# EAGLE schematic LigthBox 2.0 (EAGLE 9.6.2)
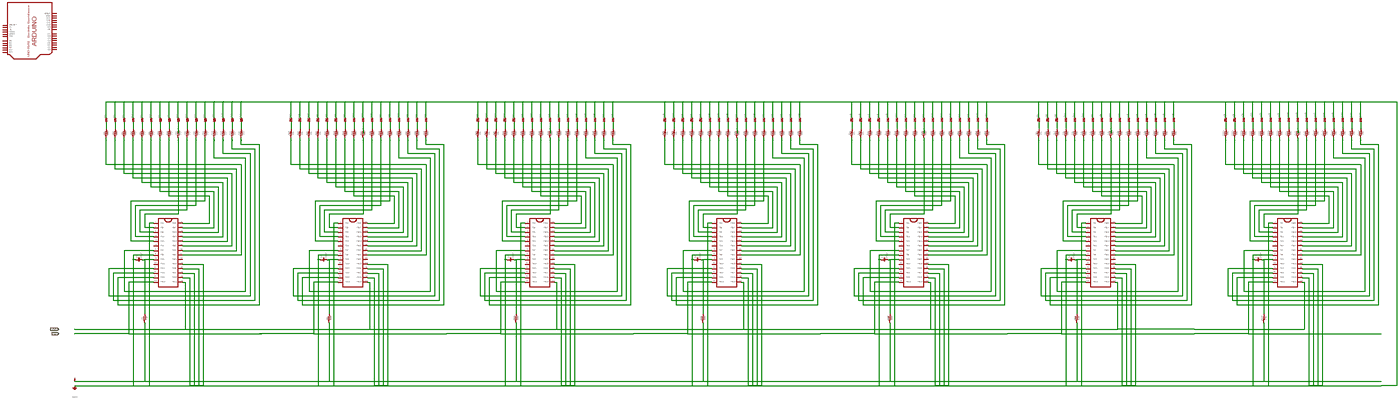
[diagram p0: schematic, sheet 1, overview]
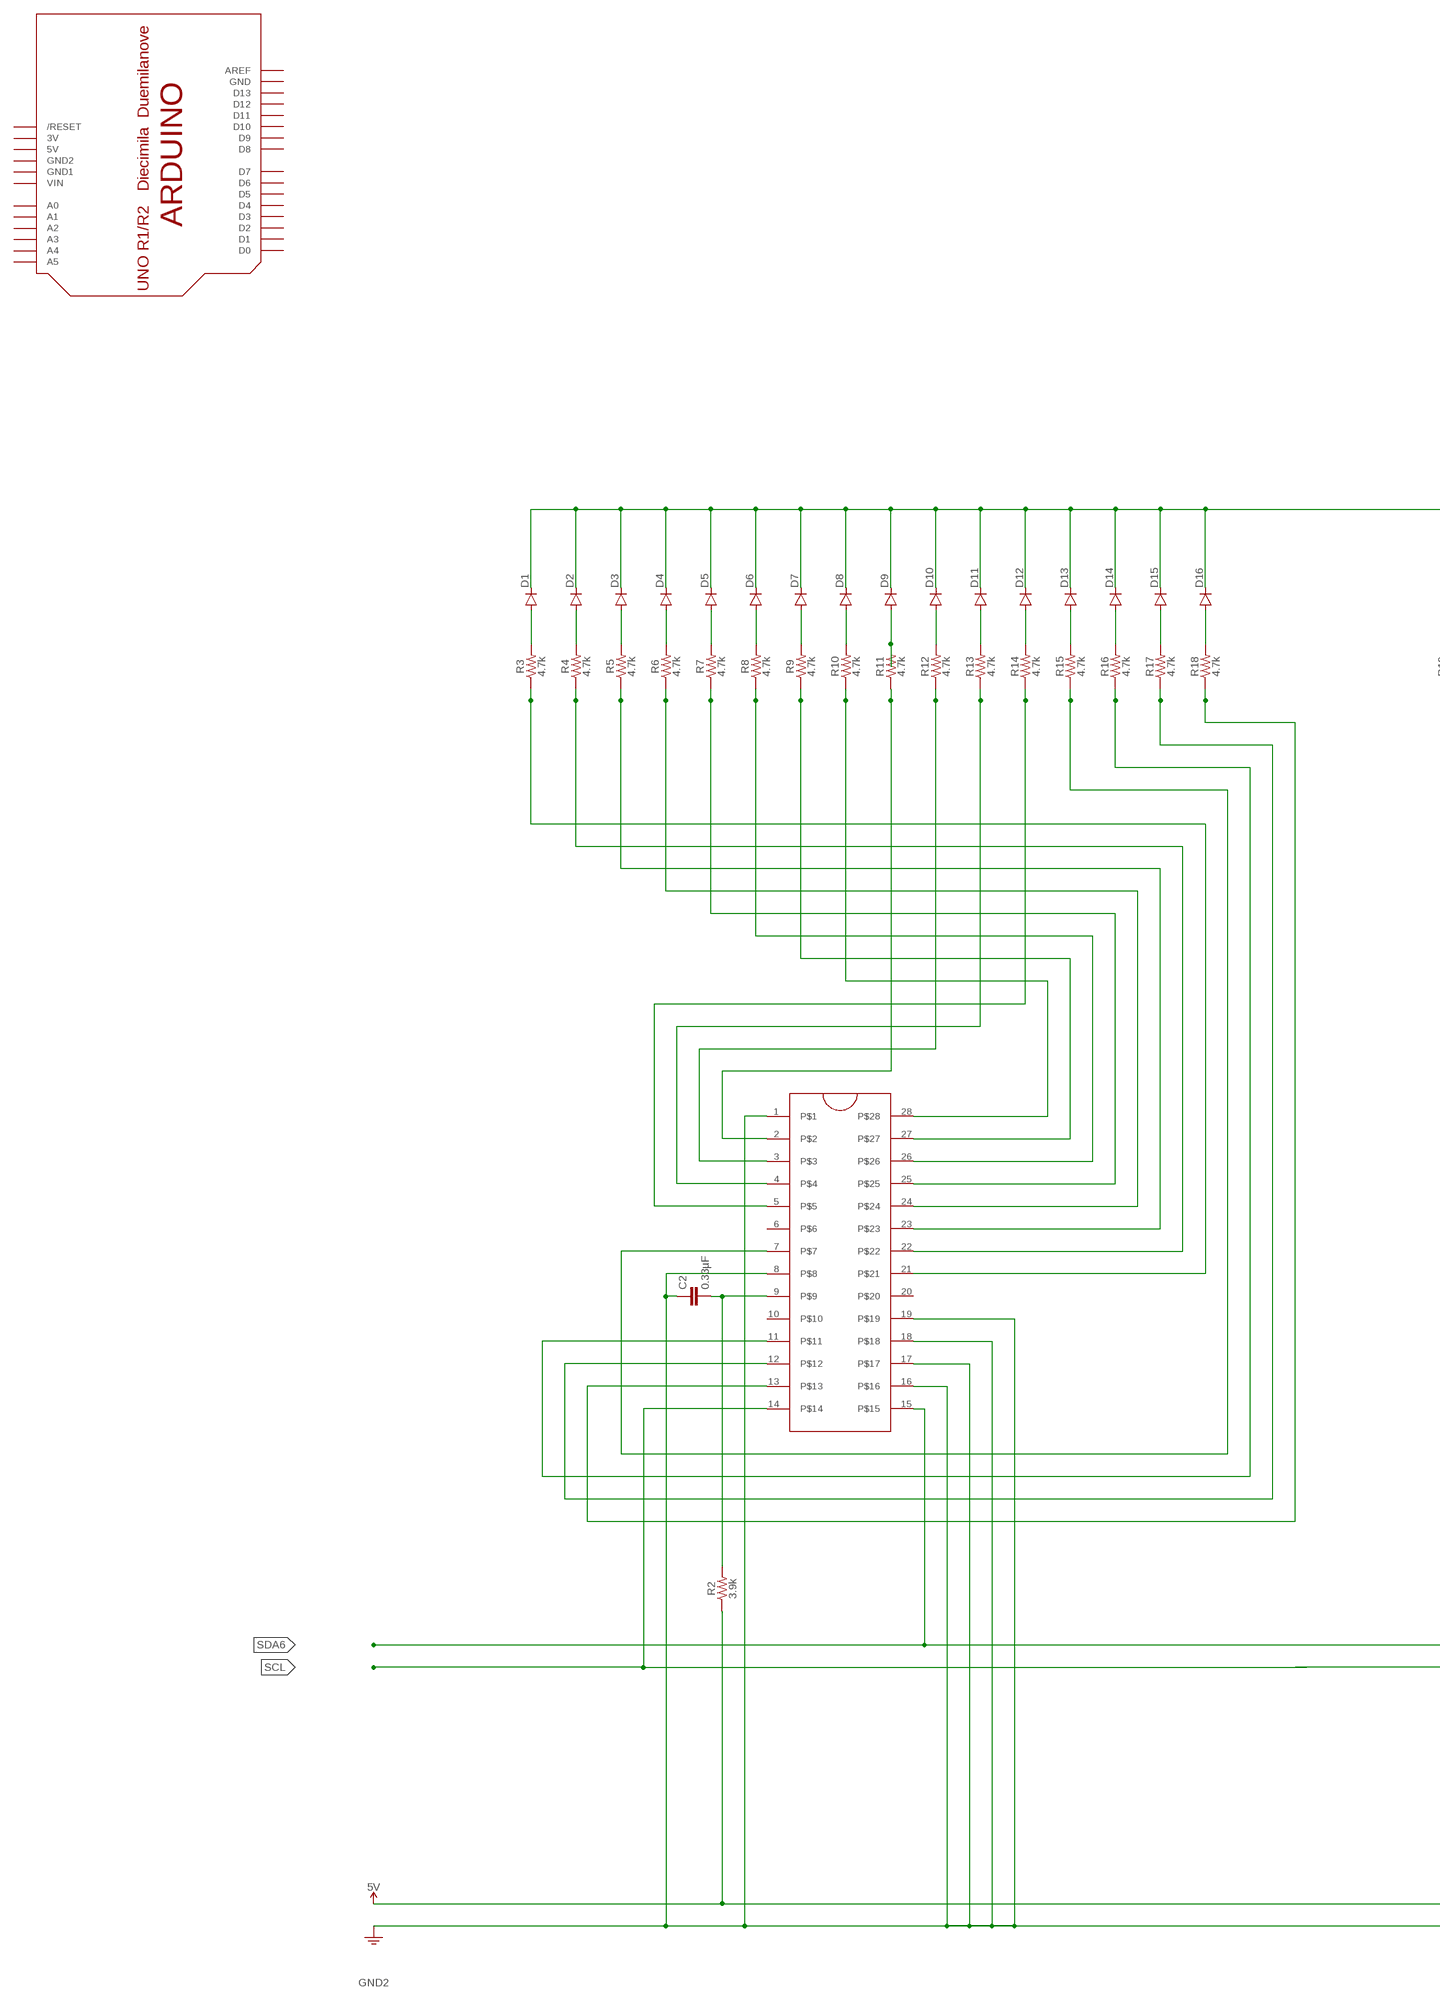
[diagram p1: schematic, sheet 1, part 1 of 4]
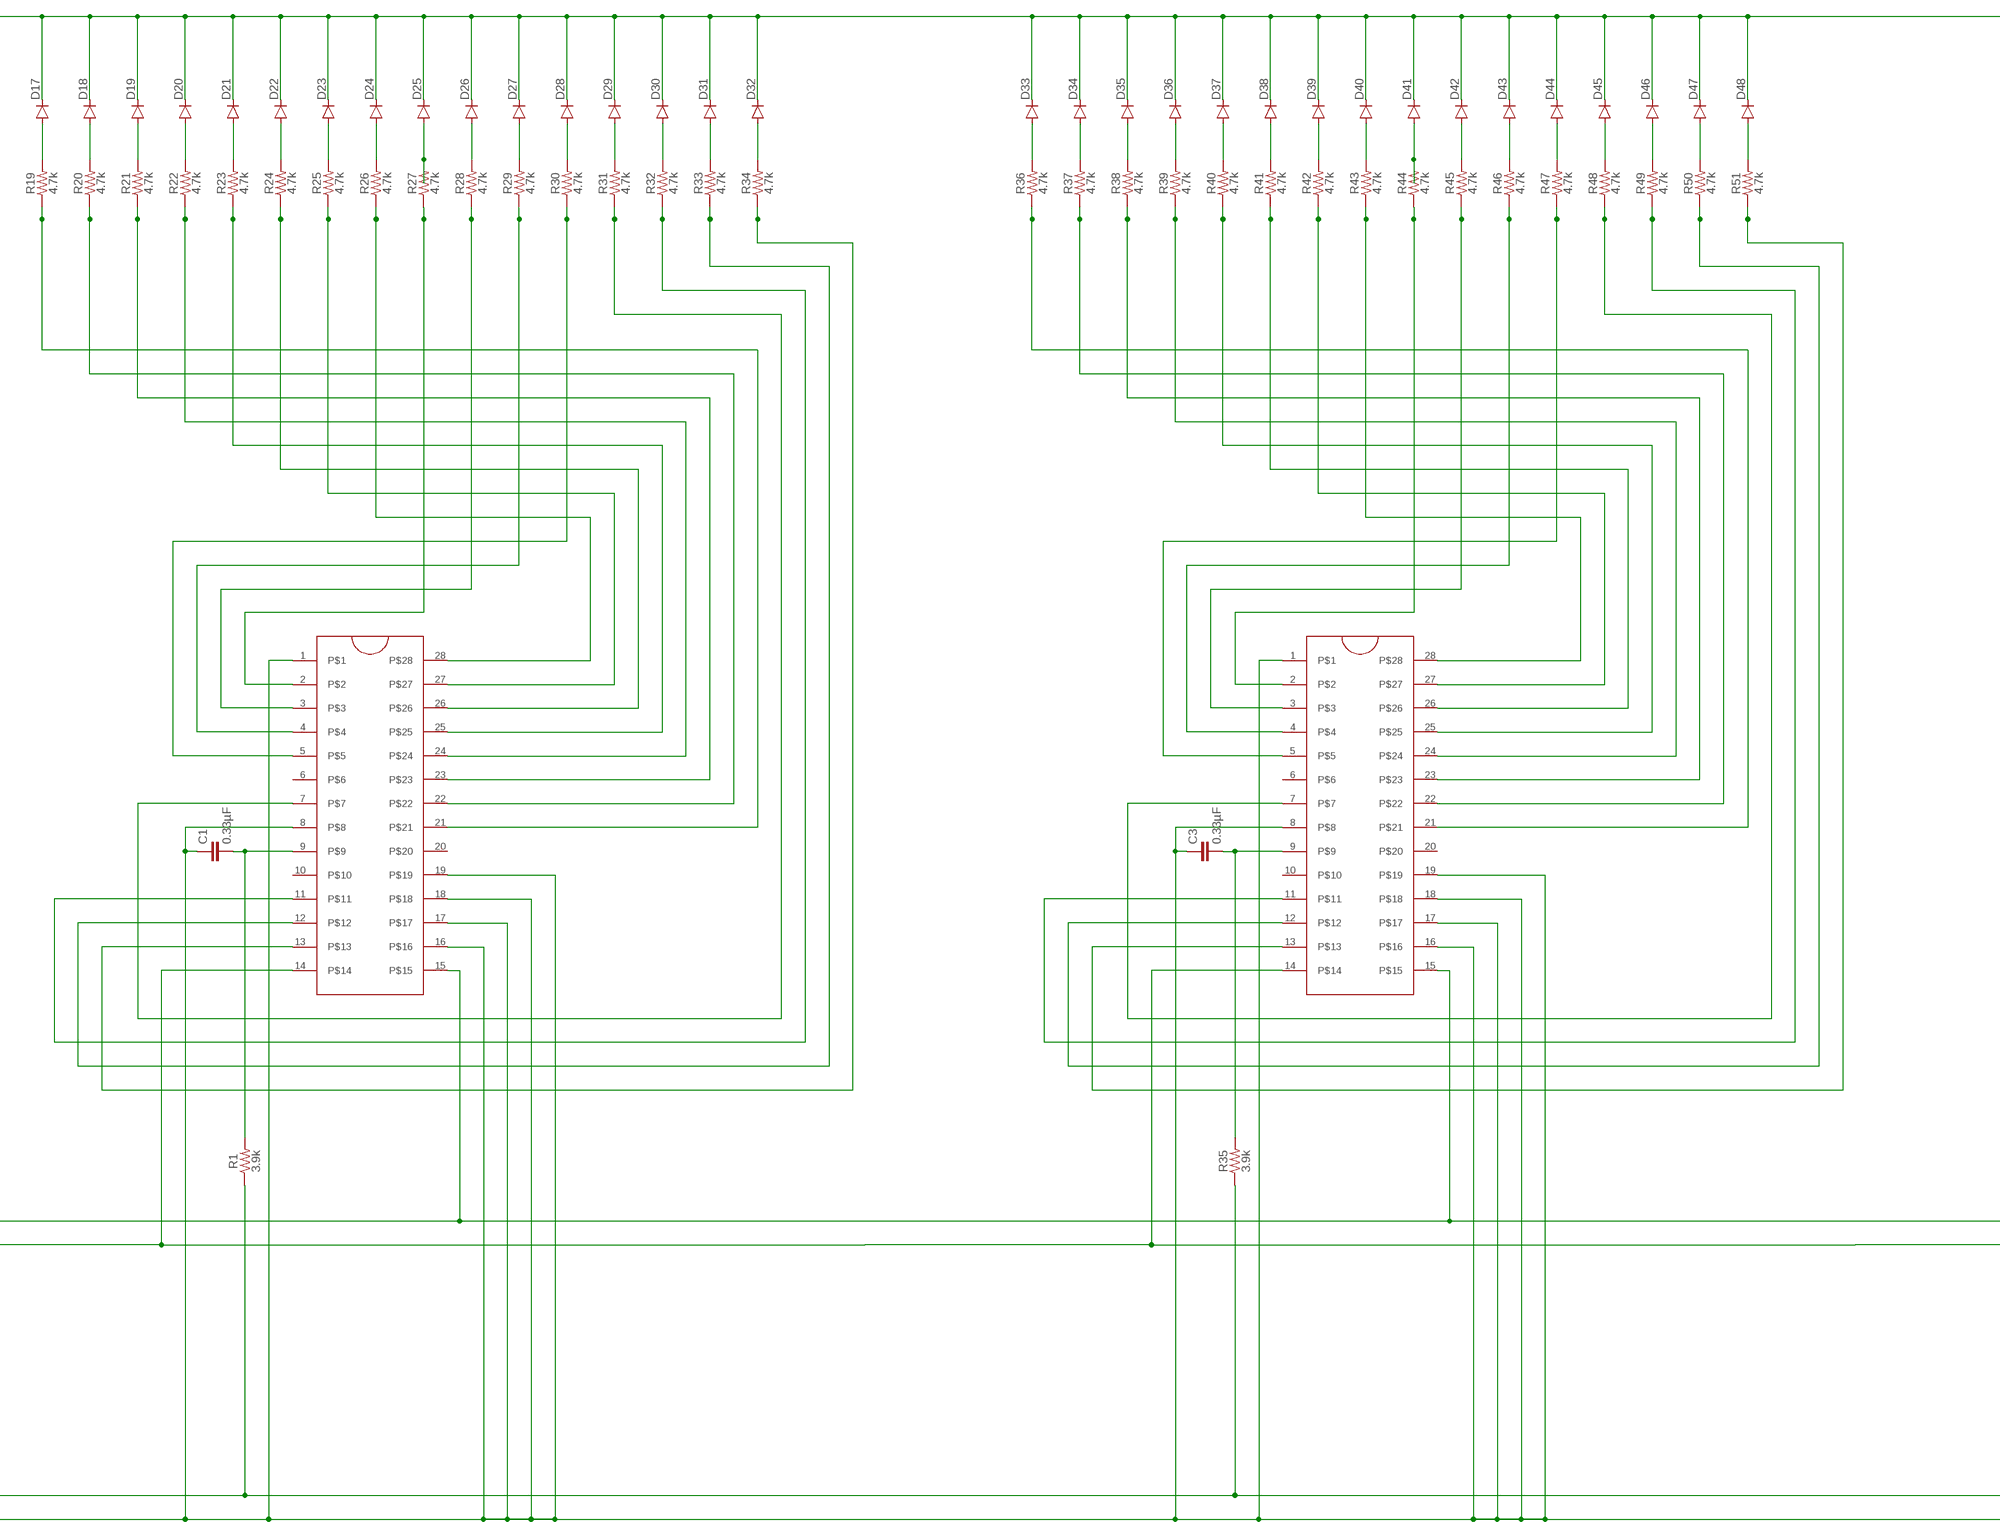
[diagram p2: schematic, sheet 1, part 2 of 4]
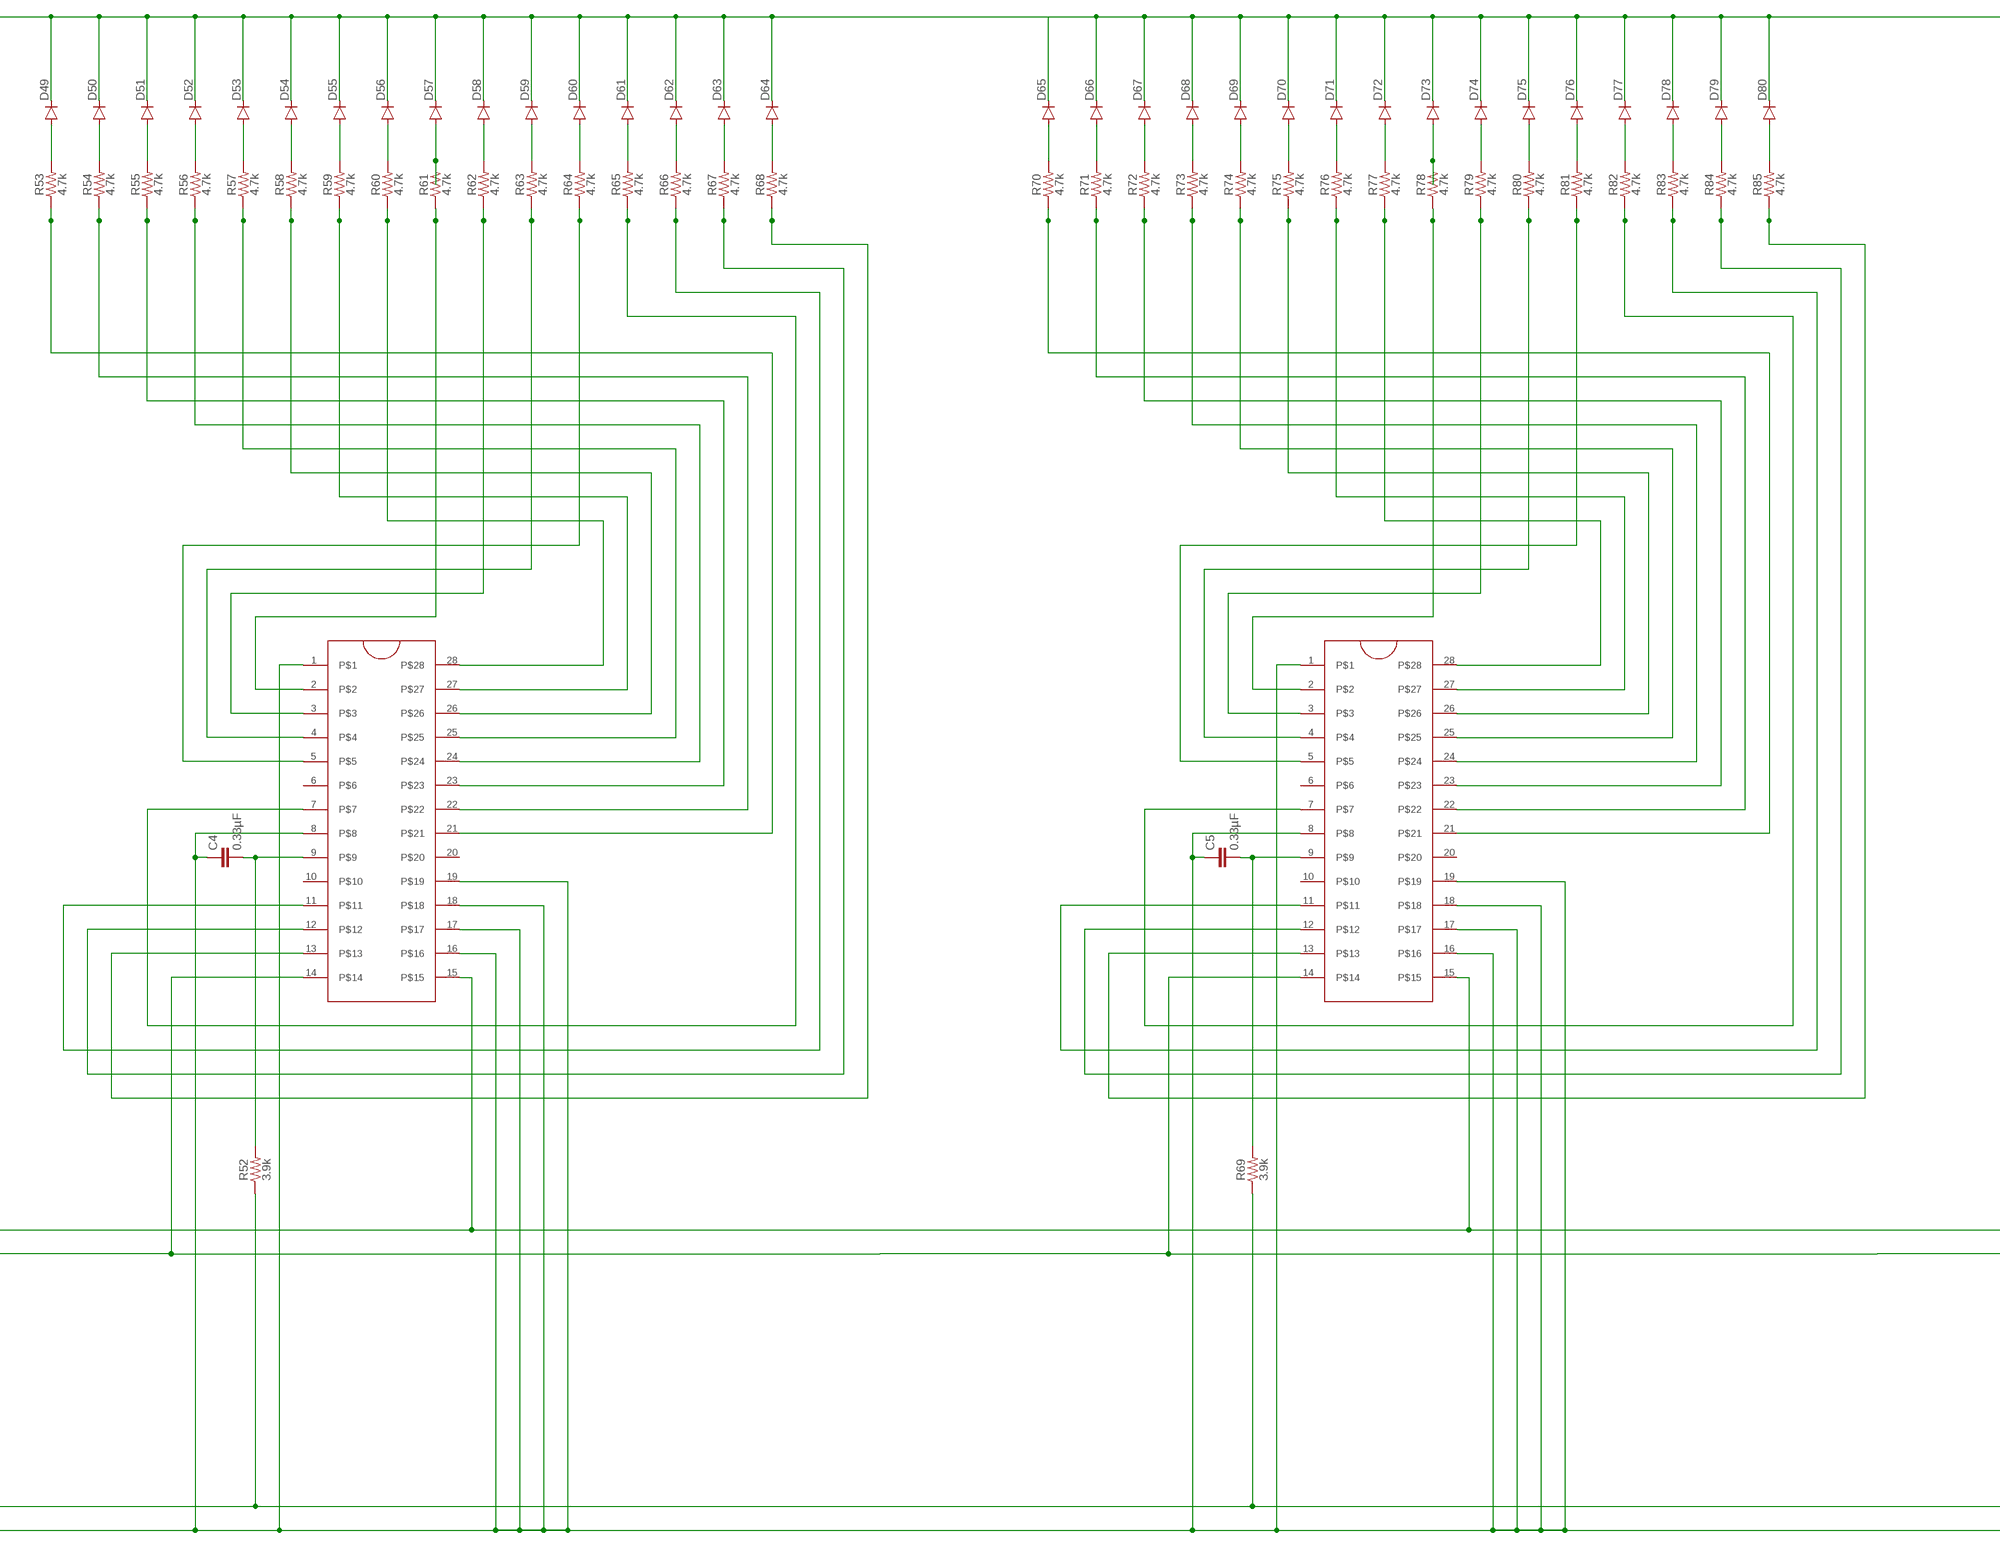
[diagram p3: schematic, sheet 1, part 3 of 4]
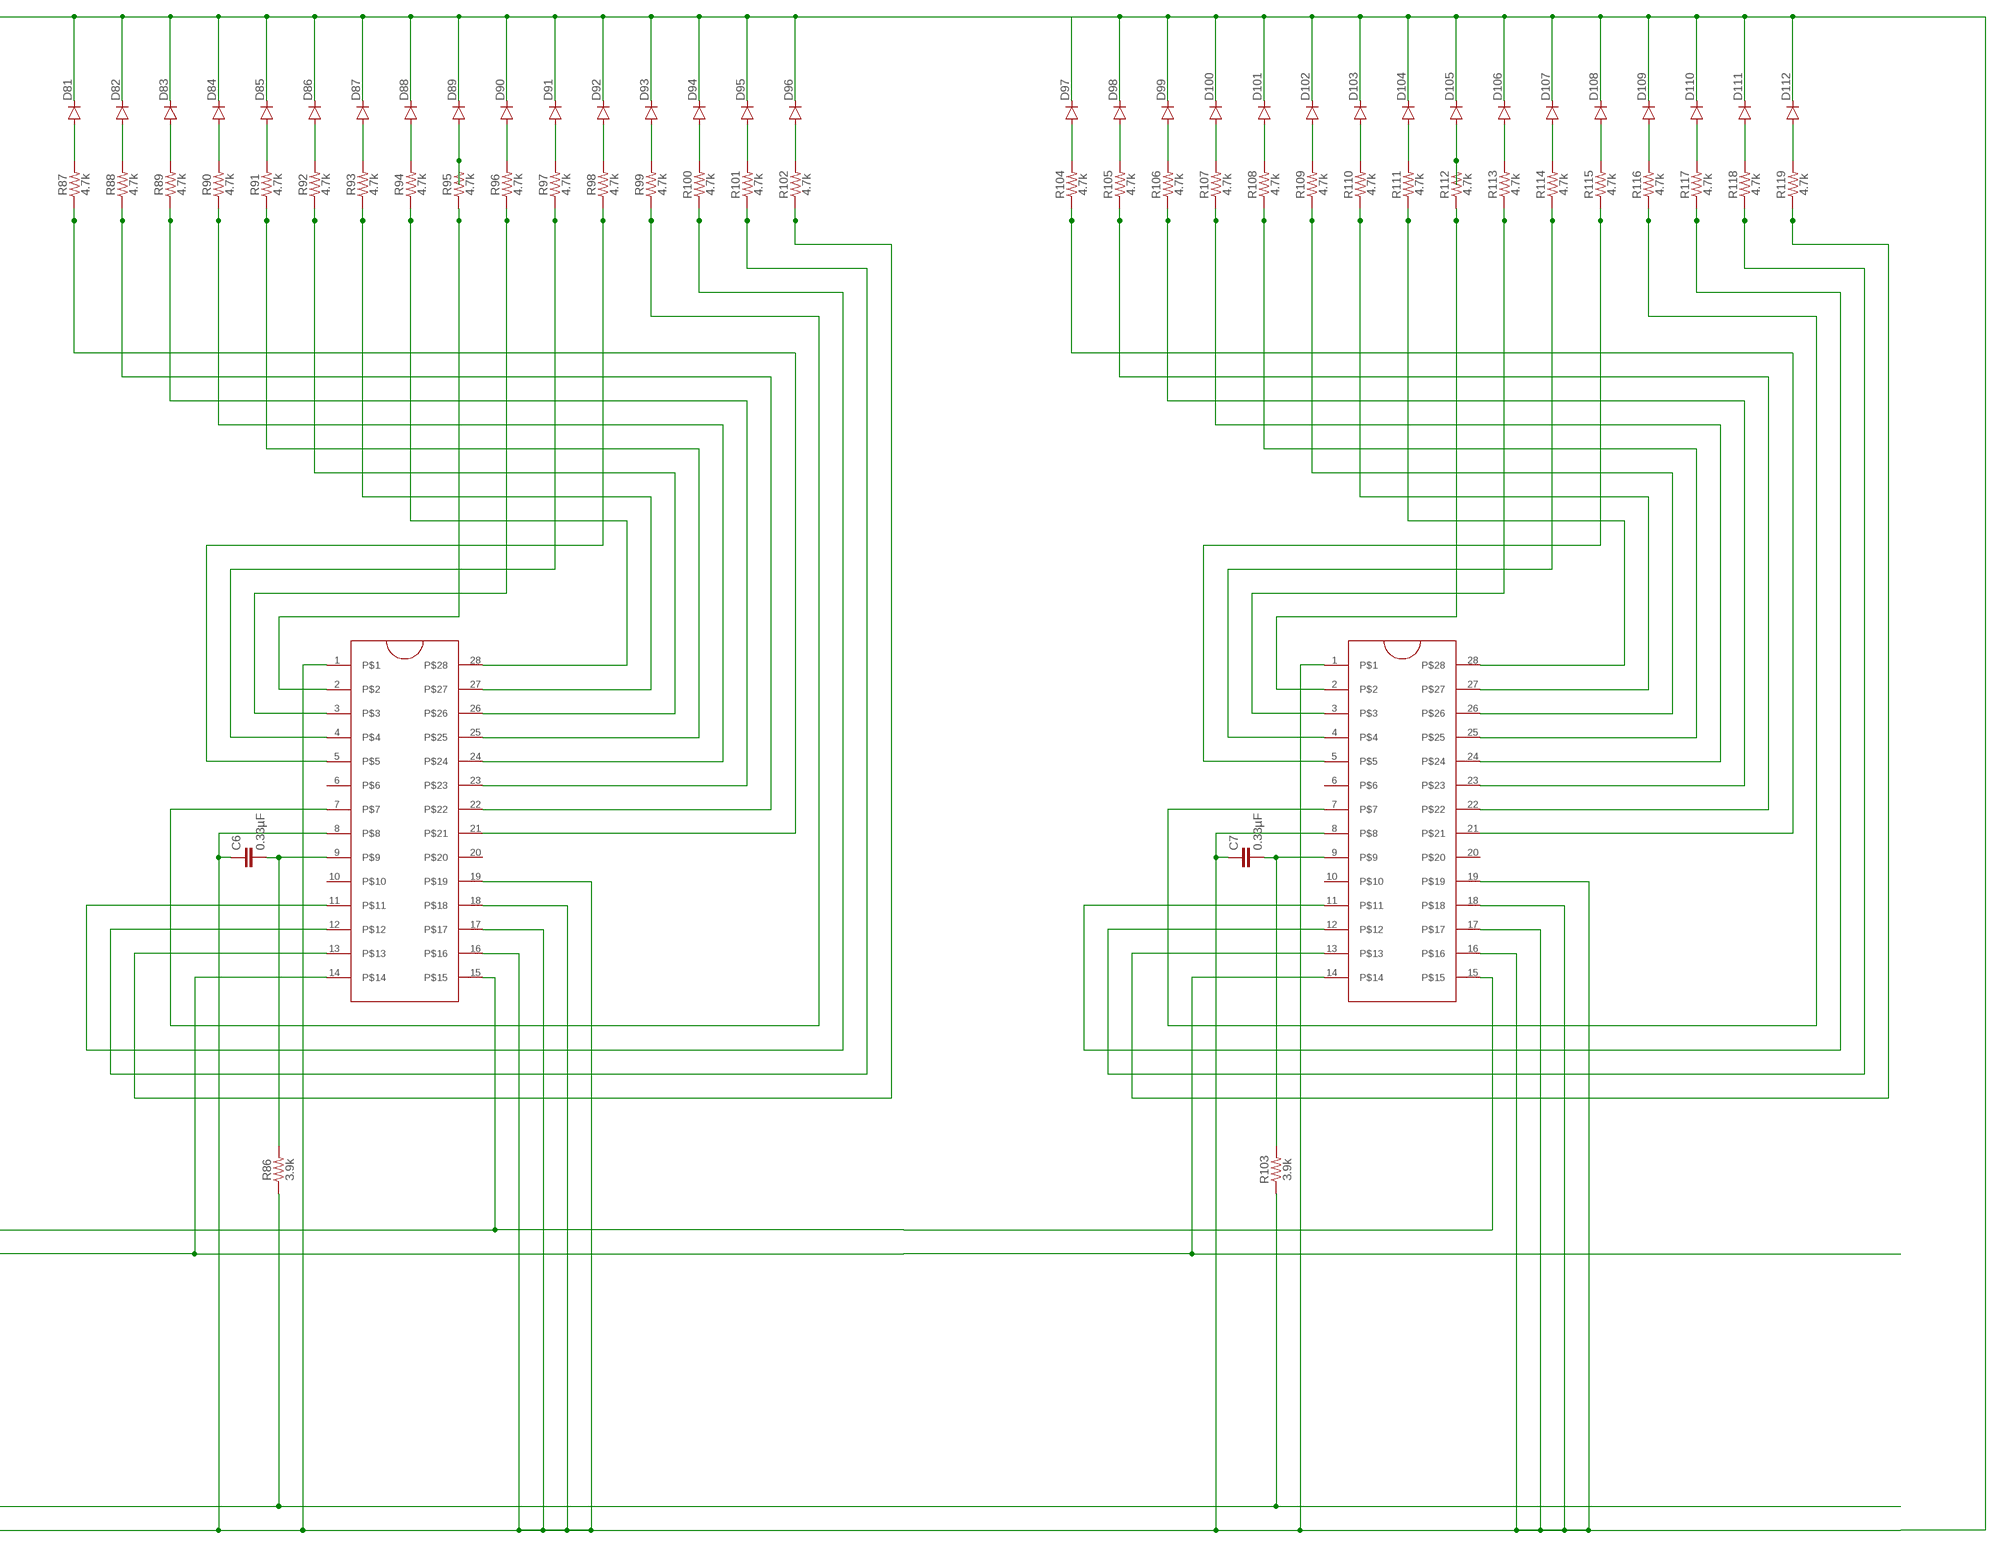
[diagram p4: schematic, sheet 1, part 4 of 4]

## Parts
C1  0.33µF  0.33UF/330NF-0805-50V-10%  [0805]
C2  0.33µF  0.33UF/330NF-0805-50V-10%  [0805]
C3  0.33µF  0.33UF/330NF-0805-50V-10%  [0805]
C4  0.33µF  0.33UF/330NF-0805-50V-10%  [0805]
C5  0.33µF  0.33UF/330NF-0805-50V-10%  [0805]
C6  0.33µF  0.33UF/330NF-0805-50V-10%  [0805]
C7  0.33µF  0.33UF/330NF-0805-50V-10%  [0805]
D1  DIODE-C1702-05  [C1702-05]
D2  DIODE-C1702-05  [C1702-05]
D3  DIODE-C1702-05  [C1702-05]
D4  DIODE-C1702-05  [C1702-05]
D5  DIODE-C1702-05  [C1702-05]
D6  DIODE-C1702-05  [C1702-05]
D7  DIODE-C1702-05  [C1702-05]
D8  DIODE-C1702-05  [C1702-05]
D9  DIODE-C1702-05  [C1702-05]
D10  DIODE-C1702-05  [C1702-05]
D11  DIODE-C1702-05  [C1702-05]
D12  DIODE-C1702-05  [C1702-05]
D13  DIODE-C1702-05  [C1702-05]
D14  DIODE-C1702-05  [C1702-05]
D15  DIODE-C1702-05  [C1702-05]
D16  DIODE-C1702-05  [C1702-05]
D17  DIODE-C1702-05  [C1702-05]
D18  DIODE-C1702-05  [C1702-05]
D19  DIODE-C1702-05  [C1702-05]
D20  DIODE-C1702-05  [C1702-05]
D21  DIODE-C1702-05  [C1702-05]
D22  DIODE-C1702-05  [C1702-05]
D23  DIODE-C1702-05  [C1702-05]
D24  DIODE-C1702-05  [C1702-05]
D25  DIODE-C1702-05  [C1702-05]
D26  DIODE-C1702-05  [C1702-05]
D27  DIODE-C1702-05  [C1702-05]
D28  DIODE-C1702-05  [C1702-05]
D29  DIODE-C1702-05  [C1702-05]
D30  DIODE-C1702-05  [C1702-05]
D31  DIODE-C1702-05  [C1702-05]
D32  DIODE-C1702-05  [C1702-05]
D33  DIODE-C1702-05  [C1702-05]
D34  DIODE-C1702-05  [C1702-05]
D35  DIODE-C1702-05  [C1702-05]
D36  DIODE-C1702-05  [C1702-05]
D37  DIODE-C1702-05  [C1702-05]
D38  DIODE-C1702-05  [C1702-05]
D39  DIODE-C1702-05  [C1702-05]
D40  DIODE-C1702-05  [C1702-05]
D41  DIODE-C1702-05  [C1702-05]
D42  DIODE-C1702-05  [C1702-05]
D43  DIODE-C1702-05  [C1702-05]
D44  DIODE-C1702-05  [C1702-05]
D45  DIODE-C1702-05  [C1702-05]
D46  DIODE-C1702-05  [C1702-05]
D47  DIODE-C1702-05  [C1702-05]
D48  DIODE-C1702-05  [C1702-05]
D49  DIODE-C1702-05  [C1702-05]
D50  DIODE-C1702-05  [C1702-05]
D51  DIODE-C1702-05  [C1702-05]
D52  DIODE-C1702-05  [C1702-05]
D53  DIODE-C1702-05  [C1702-05]
D54  DIODE-C1702-05  [C1702-05]
D55  DIODE-C1702-05  [C1702-05]
D56  DIODE-C1702-05  [C1702-05]
D57  DIODE-C1702-05  [C1702-05]
D58  DIODE-C1702-05  [C1702-05]
D59  DIODE-C1702-05  [C1702-05]
D60  DIODE-C1702-05  [C1702-05]
D61  DIODE-C1702-05  [C1702-05]
D62  DIODE-C1702-05  [C1702-05]
D63  DIODE-C1702-05  [C1702-05]
D64  DIODE-C1702-05  [C1702-05]
D65  DIODE-C1702-05  [C1702-05]
D66  DIODE-C1702-05  [C1702-05]
D67  DIODE-C1702-05  [C1702-05]
D68  DIODE-C1702-05  [C1702-05]
D69  DIODE-C1702-05  [C1702-05]
D70  DIODE-C1702-05  [C1702-05]
D71  DIODE-C1702-05  [C1702-05]
D72  DIODE-C1702-05  [C1702-05]
D73  DIODE-C1702-05  [C1702-05]
D74  DIODE-C1702-05  [C1702-05]
D75  DIODE-C1702-05  [C1702-05]
D76  DIODE-C1702-05  [C1702-05]
D77  DIODE-C1702-05  [C1702-05]
D78  DIODE-C1702-05  [C1702-05]
D79  DIODE-C1702-05  [C1702-05]
D80  DIODE-C1702-05  [C1702-05]
D81  DIODE-C1702-05  [C1702-05]
D82  DIODE-C1702-05  [C1702-05]
D83  DIODE-C1702-05  [C1702-05]
D84  DIODE-C1702-05  [C1702-05]
D85  DIODE-C1702-05  [C1702-05]
D86  DIODE-C1702-05  [C1702-05]
D87  DIODE-C1702-05  [C1702-05]
D88  DIODE-C1702-05  [C1702-05]
D89  DIODE-C1702-05  [C1702-05]
D90  DIODE-C1702-05  [C1702-05]
D91  DIODE-C1702-05  [C1702-05]
D92  DIODE-C1702-05  [C1702-05]
D93  DIODE-C1702-05  [C1702-05]
D94  DIODE-C1702-05  [C1702-05]
D95  DIODE-C1702-05  [C1702-05]
D96  DIODE-C1702-05  [C1702-05]
D97  DIODE-C1702-05  [C1702-05]
D98  DIODE-C1702-05  [C1702-05]
D99  DIODE-C1702-05  [C1702-05]
D100  DIODE-C1702-05  [C1702-05]
D101  DIODE-C1702-05  [C1702-05]
D102  DIODE-C1702-05  [C1702-05]
D103  DIODE-C1702-05  [C1702-05]
D104  DIODE-C1702-05  [C1702-05]
D105  DIODE-C1702-05  [C1702-05]
D106  DIODE-C1702-05  [C1702-05]
D107  DIODE-C1702-05  [C1702-05]
D108  DIODE-C1702-05  [C1702-05]
D109  DIODE-C1702-05  [C1702-05]
D110  DIODE-C1702-05  [C1702-05]
D111  DIODE-C1702-05  [C1702-05]
D112  DIODE-C1702-05  [C1702-05]
J1  ZIFSOCKET-28-3"  [DIL28-3-ZIF_SOCKET]
J2  ZIFSOCKET-28-3"  [DIL28-3-ZIF_SOCKET]
J3  ZIFSOCKET-28-3"  [DIL28-3-ZIF_SOCKET]
J4  ZIFSOCKET-28-3"  [DIL28-3-ZIF_SOCKET]
J5  ZIFSOCKET-28-3"  [DIL28-3-ZIF_SOCKET]
J6  ZIFSOCKET-28-3"  [DIL28-3-ZIF_SOCKET]
J7  ZIFSOCKET-28-3"  [DIL28-3-ZIF_SOCKET]
R1  3.9k  3.9KOHM-0603-1/10W-1%  [0603]
R2  3.9k  3.9KOHM-0603-1/10W-1%  [0603]
R3  4.7k  4.7KOHM-0603-1/10W-1%  [0603]
R4  4.7k  4.7KOHM-0603-1/10W-1%  [0603]
R5  4.7k  4.7KOHM-0603-1/10W-1%  [0603]
R6  4.7k  4.7KOHM-0603-1/10W-1%  [0603]
R7  4.7k  4.7KOHM-0603-1/10W-1%  [0603]
R8  4.7k  4.7KOHM-0603-1/10W-1%  [0603]
R9  4.7k  4.7KOHM-0603-1/10W-1%  [0603]
R10  4.7k  4.7KOHM-0603-1/10W-1%  [0603]
R11  4.7k  4.7KOHM-0603-1/10W-1%  [0603]
R12  4.7k  4.7KOHM-0603-1/10W-1%  [0603]
R13  4.7k  4.7KOHM-0603-1/10W-1%  [0603]
R14  4.7k  4.7KOHM-0603-1/10W-1%  [0603]
R15  4.7k  4.7KOHM-0603-1/10W-1%  [0603]
R16  4.7k  4.7KOHM-0603-1/10W-1%  [0603]
R17  4.7k  4.7KOHM-0603-1/10W-1%  [0603]
R18  4.7k  4.7KOHM-0603-1/10W-1%  [0603]
R19  4.7k  4.7KOHM-0603-1/10W-1%  [0603]
R20  4.7k  4.7KOHM-0603-1/10W-1%  [0603]
R21  4.7k  4.7KOHM-0603-1/10W-1%  [0603]
R22  4.7k  4.7KOHM-0603-1/10W-1%  [0603]
R23  4.7k  4.7KOHM-0603-1/10W-1%  [0603]
R24  4.7k  4.7KOHM-0603-1/10W-1%  [0603]
R25  4.7k  4.7KOHM-0603-1/10W-1%  [0603]
R26  4.7k  4.7KOHM-0603-1/10W-1%  [0603]
R27  4.7k  4.7KOHM-0603-1/10W-1%  [0603]
R28  4.7k  4.7KOHM-0603-1/10W-1%  [0603]
R29  4.7k  4.7KOHM-0603-1/10W-1%  [0603]
R30  4.7k  4.7KOHM-0603-1/10W-1%  [0603]
R31  4.7k  4.7KOHM-0603-1/10W-1%  [0603]
R32  4.7k  4.7KOHM-0603-1/10W-1%  [0603]
R33  4.7k  4.7KOHM-0603-1/10W-1%  [0603]
R34  4.7k  4.7KOHM-0603-1/10W-1%  [0603]
R35  3.9k  3.9KOHM-0603-1/10W-1%  [0603]
R36  4.7k  4.7KOHM-0603-1/10W-1%  [0603]
R37  4.7k  4.7KOHM-0603-1/10W-1%  [0603]
R38  4.7k  4.7KOHM-0603-1/10W-1%  [0603]
R39  4.7k  4.7KOHM-0603-1/10W-1%  [0603]
R40  4.7k  4.7KOHM-0603-1/10W-1%  [0603]
R41  4.7k  4.7KOHM-0603-1/10W-1%  [0603]
R42  4.7k  4.7KOHM-0603-1/10W-1%  [0603]
R43  4.7k  4.7KOHM-0603-1/10W-1%  [0603]
R44  4.7k  4.7KOHM-0603-1/10W-1%  [0603]
R45  4.7k  4.7KOHM-0603-1/10W-1%  [0603]
R46  4.7k  4.7KOHM-0603-1/10W-1%  [0603]
R47  4.7k  4.7KOHM-0603-1/10W-1%  [0603]
R48  4.7k  4.7KOHM-0603-1/10W-1%  [0603]
R49  4.7k  4.7KOHM-0603-1/10W-1%  [0603]
R50  4.7k  4.7KOHM-0603-1/10W-1%  [0603]
R51  4.7k  4.7KOHM-0603-1/10W-1%  [0603]
R52  3.9k  3.9KOHM-0603-1/10W-1%  [0603]
R53  4.7k  4.7KOHM-0603-1/10W-1%  [0603]
R54  4.7k  4.7KOHM-0603-1/10W-1%  [0603]
R55  4.7k  4.7KOHM-0603-1/10W-1%  [0603]
R56  4.7k  4.7KOHM-0603-1/10W-1%  [0603]
R57  4.7k  4.7KOHM-0603-1/10W-1%  [0603]
R58  4.7k  4.7KOHM-0603-1/10W-1%  [0603]
R59  4.7k  4.7KOHM-0603-1/10W-1%  [0603]
R60  4.7k  4.7KOHM-0603-1/10W-1%  [0603]
R61  4.7k  4.7KOHM-0603-1/10W-1%  [0603]
R62  4.7k  4.7KOHM-0603-1/10W-1%  [0603]
R63  4.7k  4.7KOHM-0603-1/10W-1%  [0603]
R64  4.7k  4.7KOHM-0603-1/10W-1%  [0603]
R65  4.7k  4.7KOHM-0603-1/10W-1%  [0603]
R66  4.7k  4.7KOHM-0603-1/10W-1%  [0603]
R67  4.7k  4.7KOHM-0603-1/10W-1%  [0603]
R68  4.7k  4.7KOHM-0603-1/10W-1%  [0603]
R69  3.9k  3.9KOHM-0603-1/10W-1%  [0603]
R70  4.7k  4.7KOHM-0603-1/10W-1%  [0603]
R71  4.7k  4.7KOHM-0603-1/10W-1%  [0603]
R72  4.7k  4.7KOHM-0603-1/10W-1%  [0603]
R73  4.7k  4.7KOHM-0603-1/10W-1%  [0603]
R74  4.7k  4.7KOHM-0603-1/10W-1%  [0603]
R75  4.7k  4.7KOHM-0603-1/10W-1%  [0603]
R76  4.7k  4.7KOHM-0603-1/10W-1%  [0603]
R77  4.7k  4.7KOHM-0603-1/10W-1%  [0603]
R78  4.7k  4.7KOHM-0603-1/10W-1%  [0603]
R79  4.7k  4.7KOHM-0603-1/10W-1%  [0603]
R80  4.7k  4.7KOHM-0603-1/10W-1%  [0603]
R81  4.7k  4.7KOHM-0603-1/10W-1%  [0603]
R82  4.7k  4.7KOHM-0603-1/10W-1%  [0603]
R83  4.7k  4.7KOHM-0603-1/10W-1%  [0603]
R84  4.7k  4.7KOHM-0603-1/10W-1%  [0603]
R85  4.7k  4.7KOHM-0603-1/10W-1%  [0603]
R86  3.9k  3.9KOHM-0603-1/10W-1%  [0603]
R87  4.7k  4.7KOHM-0603-1/10W-1%  [0603]
R88  4.7k  4.7KOHM-0603-1/10W-1%  [0603]
R89  4.7k  4.7KOHM-0603-1/10W-1%  [0603]
R90  4.7k  4.7KOHM-0603-1/10W-1%  [0603]
R91  4.7k  4.7KOHM-0603-1/10W-1%  [0603]
R92  4.7k  4.7KOHM-0603-1/10W-1%  [0603]
R93  4.7k  4.7KOHM-0603-1/10W-1%  [0603]
R94  4.7k  4.7KOHM-0603-1/10W-1%  [0603]
R95  4.7k  4.7KOHM-0603-1/10W-1%  [0603]
R96  4.7k  4.7KOHM-0603-1/10W-1%  [0603]
R97  4.7k  4.7KOHM-0603-1/10W-1%  [0603]
R98  4.7k  4.7KOHM-0603-1/10W-1%  [0603]
R99  4.7k  4.7KOHM-0603-1/10W-1%  [0603]
R100  4.7k  4.7KOHM-0603-1/10W-1%  [0603]
R101  4.7k  4.7KOHM-0603-1/10W-1%  [0603]
R102  4.7k  4.7KOHM-0603-1/10W-1%  [0603]
R103  3.9k  3.9KOHM-0603-1/10W-1%  [0603]
R104  4.7k  4.7KOHM-0603-1/10W-1%  [0603]
R105  4.7k  4.7KOHM-0603-1/10W-1%  [0603]
R106  4.7k  4.7KOHM-0603-1/10W-1%  [0603]
R107  4.7k  4.7KOHM-0603-1/10W-1%  [0603]
R108  4.7k  4.7KOHM-0603-1/10W-1%  [0603]
R109  4.7k  4.7KOHM-0603-1/10W-1%  [0603]
R110  4.7k  4.7KOHM-0603-1/10W-1%  [0603]
R111  4.7k  4.7KOHM-0603-1/10W-1%  [0603]
R112  4.7k  4.7KOHM-0603-1/10W-1%  [0603]
R113  4.7k  4.7KOHM-0603-1/10W-1%  [0603]
R114  4.7k  4.7KOHM-0603-1/10W-1%  [0603]
R115  4.7k  4.7KOHM-0603-1/10W-1%  [0603]
R116  4.7k  4.7KOHM-0603-1/10W-1%  [0603]
R117  4.7k  4.7KOHM-0603-1/10W-1%  [0603]
R118  4.7k  4.7KOHM-0603-1/10W-1%  [0603]
R119  4.7k  4.7KOHM-0603-1/10W-1%  [0603]
U$1  ARDUINO-BPLACE  [ARDUINO-BPLACE]

## Nets
3.3V: C2.1 J1.1 J1.8 J1.16 J1.17 J1.18 J1.19 ; supply symbol labelled GND2
3.3V2: C1.1 J2.1 J2.8 J2.16 J2.17 J2.18 J2.19
3.3V4: C3.1 J3.1 J3.8 J3.16 J3.17 J3.18 J3.19
3.3V6: C4.1 J4.1 J4.8 J4.16 J4.17 J4.18 J4.19
3.3V8: C5.1 J5.1 J5.8 J5.16 J5.17 J5.18 J5.19
3.3V10: C6.1 C7.1 D1.C D2.C D3.C D4.C D5.C D6.C D7.C D8.C D9.C D10.C D11.C D12.C D13.C D14.C D15.C D16.C D17.C D18.C D19.C D20.C D21.C D22.C D23.C D24.C D25.C D26.C D27.C D28.C D29.C D30.C D31.C D32.C D33.C D34.C D35.C D36.C D37.C D38.C D39.C D40.C D41.C D42.C D43.C D44.C D45.C D46.C D47.C D48.C D49.C D50.C D51.C D52.C D53.C D54.C D55.C D56.C D57.C D58.C D59.C D60.C D61.C D62.C D63.C D64.C D65.C D66.C D67.C D68.C D69.C D70.C D71.C D72.C D73.C D74.C D75.C D76.C D77.C D78.C D79.C D80.C D81.C D82.C D83.C D84.C D85.C D86.C D87.C D88.C D89.C D90.C D91.C D92.C D93.C D94.C D95.C D96.C D97.C D98.C D99.C D100.C D101.C D102.C D103.C D104.C D105.C D106.C D107.C D108.C D109.C D110.C D111.C D112.C J6.1 J6.8 J6.16 J6.17 J6.18 J6.19 J7.1 J7.8 J7.16 J7.17 J7.18 J7.19
5V: R2.1
5V1: R1.1
5V2: R35.1
5V3: R52.1
5V4: R69.1
5V5: R86.1
5V6: R103.1
N$1: J1.11 R16.1
N$2: C2.2 J1.9 R2.2
N$3: J1.12 R17.1
N$4: J1.13 R18.1
N$5: D4.A R6.2
N$6: D5.A R7.2
N$7: D6.A R8.2
N$8: D1.A R3.2
N$9: D2.A R4.2
N$10: D7.A R9.2
N$11: D8.A R10.2
N$12: D9.A R11.2
N$13: D10.A R12.2
N$14: D11.A R13.2
N$15: D12.A R14.2
N$16: D13.A R15.2
N$17: D14.A R16.2
N$18: D15.A R17.2
N$19: D16.A R18.2
N$20: C1.2 J2.9 R1.2
N$21: D17.A R19.2
N$22: D18.A R20.2
N$23: D19.A R21.2
N$24: J2.21 R19.1
N$25: J2.22 R20.1
N$26: D3.A R5.2
N$27: J1.21 R3.1
N$28: J1.22 R4.1
N$29: J1.23 R5.1
N$30: J1.24 R6.1
N$31: J1.25 R7.1
N$32: J1.26 R8.1
N$33: J2.23 R21.1
N$34: J1.27 R9.1
N$35: J1.28 R10.1
N$36: J1.2 R11.1
N$37: J1.3 R12.1
N$38: J1.4 R13.1
N$39: J1.5 R14.1
N$40: J2.24 R22.1
N$41: J1.7 R15.1
N$42: J2.25 R23.1
N$43: J2.26 R24.1
N$44: J2.27 R25.1
N$45: J2.28 R26.1
N$46: J2.2 R27.1
N$47: J2.3 R28.1
N$48: J2.4 R29.1
N$49: J2.5 R30.1
N$50: J2.7 R31.1
N$51: J2.11 R32.1
N$52: J2.12 R33.1
N$53: J2.13 R34.1
N$54: D20.A R22.2
N$55: D21.A R23.2
N$56: D22.A R24.2
N$57: D23.A R25.2
N$58: D24.A R26.2
N$59: D25.A R27.2
N$60: D26.A R28.2
N$61: D27.A R29.2
N$62: D28.A R30.2
N$63: D29.A R31.2
N$64: D30.A R32.2
N$65: D31.A R33.2
N$66: D32.A R34.2
N$67: C3.2 J3.9 R35.2
N$68: D33.A R36.2
N$69: D34.A R37.2
N$70: D35.A R38.2
N$71: J3.21 R36.1
N$72: J3.22 R37.1
N$73: J3.23 R38.1
N$74: J3.24 R39.1
N$75: J3.25 R40.1
N$76: J3.26 R41.1
N$77: J3.27 R42.1
N$78: J3.28 R43.1
N$79: J3.2 R44.1
N$80: J3.3 R45.1
N$81: J3.4 R46.1
N$82: J3.5 R47.1
N$83: J3.7 R48.1
N$84: J3.11 R49.1
N$85: J3.12 R50.1
N$86: J3.13 R51.1
N$87: D36.A R39.2
N$88: D37.A R40.2
N$89: D38.A R41.2
N$90: D39.A R42.2
N$91: D40.A R43.2
N$92: D41.A R44.2
N$93: D42.A R45.2
N$94: D43.A R46.2
N$95: D44.A R47.2
N$96: D45.A R48.2
N$97: D46.A R49.2
N$98: D47.A R50.2
N$99: D48.A R51.2
N$100: C4.2 J4.9 R52.2
N$101: D49.A R53.2
N$102: D50.A R54.2
N$103: D51.A R55.2
N$104: J4.21 R53.1
N$105: J4.22 R54.1
N$106: J4.23 R55.1
N$107: J4.24 R56.1
N$108: J4.25 R57.1
N$109: J4.26 R58.1
N$110: J4.27 R59.1
N$111: J4.28 R60.1
N$112: J4.2 R61.1
N$113: J4.3 R62.1
N$114: J4.4 R63.1
N$115: J4.5 R64.1
N$116: J4.7 R65.1
N$117: J4.11 R66.1
N$118: J4.12 R67.1
N$119: J4.13 R68.1
N$120: D52.A R56.2
N$121: D53.A R57.2
N$122: D54.A R58.2
N$123: D55.A R59.2
N$124: D56.A R60.2
N$125: D57.A R61.2
N$126: D58.A R62.2
N$127: D59.A R63.2
N$128: D60.A R64.2
N$129: D61.A R65.2
N$130: D62.A R66.2
N$131: D63.A R67.2
N$132: D64.A R68.2
N$133: C5.2 J5.9 R69.2
N$134: D65.A R70.2
N$135: D66.A R71.2
N$136: D67.A R72.2
N$137: J5.21 R70.1
N$138: J5.22 R71.1
N$139: J5.23 R72.1
N$140: J5.24 R73.1
N$141: J5.25 R74.1
N$142: J5.26 R75.1
N$143: J5.27 R76.1
N$144: J5.28 R77.1
N$145: J5.2 R78.1
N$146: J5.3 R79.1
N$147: J5.4 R80.1
N$148: J5.5 R81.1
N$149: J5.7 R82.1
N$150: J5.11 R83.1
N$151: J5.12 R84.1
N$152: J5.13 R85.1
N$153: D68.A R73.2
N$154: D69.A R74.2
N$155: D70.A R75.2
N$156: D71.A R76.2
N$157: D72.A R77.2
N$158: D73.A R78.2
N$159: D74.A R79.2
N$160: D75.A R80.2
N$161: D76.A R81.2
N$162: D77.A R82.2
N$163: D78.A R83.2
N$164: D79.A R84.2
N$165: D80.A R85.2
N$166: C6.2 J6.9 R86.2
N$167: D81.A R87.2
N$168: D82.A R88.2
N$169: D83.A R89.2
N$170: J6.21 R87.1
N$171: J6.22 R88.1
N$172: J6.23 R89.1
N$173: J6.24 R90.1
N$174: J6.25 R91.1
N$175: J6.26 R92.1
N$176: J6.27 R93.1
N$177: J6.28 R94.1
N$178: J6.2 R95.1
N$179: J6.3 R96.1
N$180: J6.4 R97.1
N$181: J6.5 R98.1
N$182: J6.7 R99.1
N$183: J6.11 R100.1
N$184: J6.12 R101.1
N$185: J6.13 R102.1
N$186: D84.A R90.2
N$187: D85.A R91.2
N$188: D86.A R92.2
N$189: D87.A R93.2
N$190: D88.A R94.2
N$191: D89.A R95.2
N$192: D90.A R96.2
N$193: D91.A R97.2
N$194: D92.A R98.2
N$195: D93.A R99.2
N$196: D94.A R100.2
N$197: D95.A R101.2
N$198: D96.A R102.2
N$199: C7.2 J7.9 R103.2
N$200: D97.A R104.2
N$201: D98.A R105.2
N$202: D99.A R106.2
N$203: J7.21 R104.1
N$204: J7.22 R105.1
N$205: J7.23 R106.1
N$206: J7.24 R107.1
N$207: J7.25 R108.1
N$208: J7.26 R109.1
N$209: J7.27 R110.1
N$210: J7.28 R111.1
N$211: J7.2 R112.1
N$212: J7.3 R113.1
N$213: J7.4 R114.1
N$214: J7.5 R115.1
N$215: J7.7 R116.1
N$216: J7.11 R117.1
N$217: J7.12 R118.1
N$218: J7.13 R119.1
N$219: D100.A R107.2
N$220: D101.A R108.2
N$221: D102.A R109.2
N$222: D103.A R110.2
N$223: D104.A R111.2
N$224: D105.A R112.2
N$225: D106.A R113.2
N$226: D107.A R114.2
N$227: D108.A R115.2
N$228: D109.A R116.2
N$229: D110.A R117.2
N$230: D111.A R118.2
N$231: D112.A R119.2
SCL: J1.14
SCL1: J2.14
SCL2: J3.14
SCL3: J4.14
SCL4: J5.14
SCL5: J6.14
SCL6: J7.14
SDA6: J1.15 J2.15 J3.15 J4.15 J5.15 J6.15 J7.15
Unconnected: J1.6 J1.10 J1.20 J2.6 J2.10 J2.20 J3.6 J3.10 J3.20 J4.6 J4.10 J4.20 J5.6 J5.10 J5.20 J6.6 J6.10 J6.20 J7.6 J7.10 J7.20 U$1.A0 U$1.A1 U$1.A2 U$1.A3 U$1.A4 U$1.A5 U$1.AREF U$1.D0 U$1.D1 U$1.D2 U$1.D3 U$1.D4 U$1.D5 U$1.D6 U$1.D7 U$1.D8 U$1.D9 U$1.D10 U$1.D11 U$1.D12 U$1.D13 U$1.RESET(/RESET)

## Power pins joined to a net without a drawn wire
3V: U$1.3V
5V: U$1.5V
GND: U$1.GND
GND1: U$1.GND1
GND2: U$1.GND2
VIN: U$1.VIN

## Library data of the parts
C1-C7 = SparkFun-Capacitors:0.33UF/330NF: 0.33µF/330nF ceramic capacitors A capacitor is a passive two-terminal electrical component used to store electrical energy temporarily in an electric field.; PROD_ID: CAP-08469
D1-D112 = diode:DIODE-: DIODE
J1-J7 = SparkFun-Connectors:ZIFSOCKET-28-3: ZIF Socket 28-Pin 0.3" Lever-action ZIF socket for 28-pin ICs SparkFun Products: ZIF Socket 28-Pin <https://www.sparkfun.com/products/9175>; PROD_ID: CONN-10960; SF_ID: PRT-09175
R1 R2 R35 R52 R69 R86 R103 = SparkFun-Resistors:3.9KOHM: 3.9kΩ resistor A resistor is a passive two-terminal electrical component that implements electrical resistance as a circuit element. Resistors act to reduce current flow, and, at the same time, act to lower voltage levels within circuits. - Wikipedia; PROD_ID: RES-08701
R3-R34 R36-R51 R53-R68 R70-R85 R87-R102 R104-R119 = SparkFun-Resistors:4.7KOHM: 4.7kΩ resistor A resistor is a passive two-terminal electrical component that implements electrical resistance as a circuit element. Resistors act to reduce current flow, and, at the same time, act to lower voltage levels within circuits. - Wikipedia; PROD_ID: RES-07857
U$1 = adafruit:ARDUINO: Arduino Diecimila/Duemilanove Make a shield with ease, this package has all the named pins as well as the two mounting drill holes and an outline of the USB and DC power connector. The outline is on the DIMENSION layer, so if your board house uses it they will cut the outline to match. http://www.ladyada.net/library/pcb/eaglelibrary.html